# Altium schematic sheet adc.SchDoc: ADC
size A4; DrawnBy: Stefan Lippuner; Organization: TIK; DocumentNumber: 4; Revision: 1; SheetNumber: 4; SheetTotal: 8
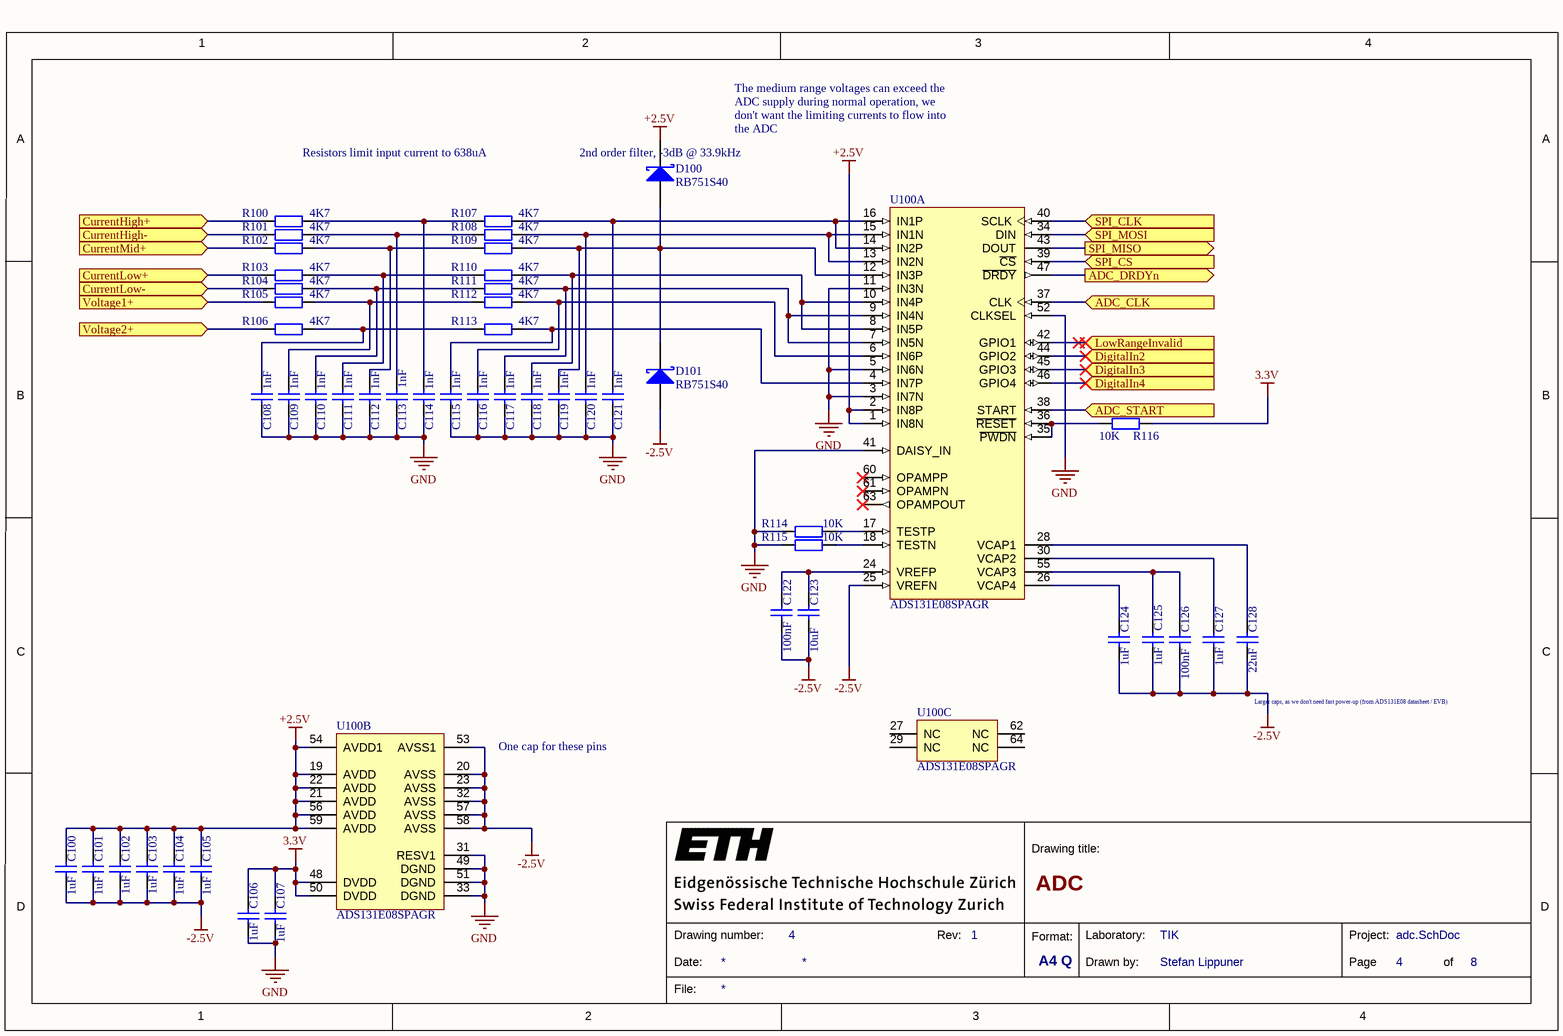
[diagram p0: adc.SchDoc]

## Parts
C100  1uF  [CAPC0402(1005)60_L]
C101  1uF  [CAPC0402(1005)60_L]
C102  1uF  [CAPC0402(1005)60_L]
C103  1uF  [CAPC0402(1005)60_L]
C104  1uF  [CAPC0402(1005)60_L]
C105  1uF  [CAPC0402(1005)60_L]
C106  1uF  [CAPC0402(1005)60_L]
C107  1uF  [CAPC0402(1005)60_L]
C108  1nF  [CAPC0402(1005)60_L]
C109  1nF  [CAPC0402(1005)60_L]
C110  1nF  [CAPC0402(1005)60_L]
C111  1nF  [CAPC0402(1005)60_L]
C112  1nF  [CAPC0402(1005)60_L]
C113  1nF  [CAPC0402(1005)60_L]
C114  1nF  [CAPC0402(1005)60_L]
C115  1nF  [CAPC0402(1005)60_L]
C116  1nF  [CAPC0402(1005)60_L]
C117  1nF  [CAPC0402(1005)60_L]
C118  1nF  [CAPC0402(1005)60_L]
C119  1nF  [CAPC0402(1005)60_L]
C120  1nF  [CAPC0402(1005)60_L]
C121  1nF  [CAPC0402(1005)60_L]
C122  100nF  [CAPC0402(1005)60_L]
C123  10uF  [CAPC0603(1608)100_L]
C124  1uF  [CAPC0402(1005)60_L]
C125  1uF  [CAPC0402(1005)60_L]
C126  100nF  [CAPC0402(1005)60_L]
C127  1uF  [CAPC0402(1005)60_L]
C128  22uF  [CAPC0805(2012)145_L]
D100  RB751S40  [ONSC-SOD-523-2-502-01_V]
D101  RB751S40  [ONSC-SOD-523-2-502-01_V]
R100  4K7  [RESC0402(1005)_L]
R101  4K7  [RESC0402(1005)_L]
R102  4K7  [RESC0402(1005)_L]
R103  4K7  [RESC0402(1005)_L]
R104  4K7  [RESC0402(1005)_L]
R105  4K7  [RESC0402(1005)_L]
R106  4K7  [RESC0402(1005)_L]
R107  4K7  [RESC0402(1005)_L]
R108  4K7  [RESC0402(1005)_L]
R109  4K7  [RESC0402(1005)_L]
R110  4K7  [RESC0402(1005)_L]
R111  4K7  [RESC0402(1005)_L]
R112  4K7  [RESC0402(1005)_L]
R113  4K7  [RESC0402(1005)_L]
R114  10K  [RESC0402(1005)_L]
R115  10K  [RESC0402(1005)_L]
R116  10K  [RESC0402(1005)_L]
U100  ADS131E08SPAGR  [QFP50P1000X1000X120_HS-64L]  (parts A,B,C of 3)

## Ports
ADC_CLK (in), ADC_DRDYn (out), ADC_START (in), CurrentHigh+ (in), CurrentHigh- (in), CurrentLow+ (in), CurrentLow- (in), CurrentMid+ (in), DigitalIn2 (in), DigitalIn3 (in), DigitalIn4 (in), LowRangeInvalid (in), SPI_CLK (in), SPI_CS (in), SPI_MISO (out), SPI_MOSI (in), Voltage1+ (in), Voltage2+ (in)

## Nets
3.3V: C106.2 C107.2 R116.1 U100.48(DVDD) U100.50(DVDD)
+2.5V: C100.2 C101.2 C102.2 C103.2 C104.2 C105.2 D100.1(K) U100.1(IN8N) U100.2(IN8P) U100.19(AVDD) U100.21(AVDD) U100.22(AVDD) U100.54(AVDD1) U100.56(AVDD) U100.59(AVDD)
-2.5V: C100.1 C101.1 C102.1 C103.1 C104.1 C105.1 C122.1 C123.1 C124.1 C125.1 C126.1 C127.1 C128.1 D101.2(A) U100.20(AVSS) U100.23(AVSS) U100.25(VREFN) U100.32(AVSS) U100.53(AVSS1) U100.57(AVSS) U100.58(AVSS)
GND: C106.1 C107.1 C108.1 C109.1 C110.1 C111.1 C112.1 C113.1 C114.1 C115.1 C116.1 C117.1 C118.1 C119.1 C120.1 C121.1 R114.1 R115.1 U100.3(IN7N) U100.5(IN6N) U100.11(IN3N) U100.31(RESV1) U100.33(DGND) U100.41(DAISY_IN) U100.49(DGND) U100.51(DGND) U100.52(CLKSEL)
ADC_CLK: U100.37(CLK) ; port ADC_CLK
ADC_DRDYn: U100.47(~{DRDY}) ; port ADC_DRDYn
ADC_START: U100.38(START) ; port ADC_START
CurrentHigh+: R100.2 ; port CurrentHigh+
CurrentHigh-: R101.2 ; port CurrentHigh-
CurrentLow+: R103.2 ; port CurrentLow+
CurrentLow-: R104.2 ; port CurrentLow-
CurrentMid+: R102.2 ; port CurrentMid+
DigitalIn2: U100.44(GPIO2) ; port DigitalIn2
DigitalIn3: U100.45(GPIO3) ; port DigitalIn3
DigitalIn4: U100.46(GPIO4) ; port DigitalIn4
LowRangeInvalid: U100.42(GPIO1) ; port LowRangeInvalid
SPI_CLK: U100.40(SCLK) ; port SPI_CLK
SPI_CS: U100.39(~{CS}) ; port SPI_CS
SPI_MISO: U100.43(DOUT) ; port SPI_MISO
SPI_MOSI: U100.34(DIN) ; port SPI_MOSI
Voltage1+: R105.2 ; port Voltage1+
Voltage2+: R106.2 ; port Voltage2+
NetC108_2: C108.2 R106.1 R113.2
NetC109_2: C109.2 R105.1 R112.2
NetC110_2: C110.2 R104.1 R111.2
NetC111_2: C111.2 R103.1 R110.2
NetC112_2: C112.2 R102.1 R109.2
NetC113_2: C113.2 R101.1 R108.2
NetC114_2: C114.2 R100.1 R107.2
NetC115_2: C115.2 R113.1 U100.4(IN7P)
NetC116_2: C116.2 R112.1 U100.6(IN6P)
NetC117_2: C117.2 R111.1 U100.7(IN5N) U100.9(IN4N)
NetC118_2: C118.2 R110.1 U100.8(IN5P) U100.10(IN4P)
NetC119_2: C119.2 D100.2(A) D101.1(K) R109.1 U100.12(IN3P)
NetC120_2: C120.2 R108.1 U100.13(IN2N) U100.15(IN1N)
NetC121_2: C121.2 R107.1 U100.14(IN2P) U100.16(IN1P)
NetC122_2: C122.2 C123.2 U100.24(VREFP)
NetC124_2: C124.2 U100.26(VCAP4)
NetC125_2: C125.2 C126.2 U100.55(VCAP3)
NetC127_2: C127.2 U100.30(VCAP2)
NetC128_2: C128.2 U100.28(VCAP1)
NetR114_2: R114.2 U100.17(TESTP)
NetR115_2: R115.2 U100.18(TESTN)
NetR116_2: R116.2 U100.35(~{PWDN}) U100.36(~{RESET})

Not connected (* = marked no-connect by the designer): U100 27(NC) 29(NC) 60(OPAMPP)* 61(OPAMPN)* 62(NC) 63(OPAMPOUT)* 64(NC)

## Notes on the sheet
- Resistors limit input current to 638uA
- 2nd order filter, -3dB @ 33.9kHz
- The medium range voltages can exceed the ADC supply during normal operation, we don't want the limiting currents to flow into the ADC
- Larger caps, as we don't need fast power-up (from ADS131E08 datasheet / EVB)
- One cap for these pins
- 1
- 2
- 3
- 4
- A
- B
- C
- Drawing title:
- D
- Date:
- Drawing number:
- Rev:
- Format:
- A4 Q
- Drawn by:
- Laboratory:
- Page
- Project:
- of
- File:

## Library data of the parts
C100-C107 C124 C125 C127 = CMP-1034-02120-1: CAP 1uF 16V ±20% 0402 (1005 Metric) Thickness 0.6mm SMD; Tolerance: Â±20%; Case-EIA: 0402; Case-Metric: 1005; Max Thickness: 0.6 mm; Rated Voltage: 16 V; Value: 1uF; Technology: SMT
C108-C121 = CMP-1034-01626-1: CAP 1nF 50V ±5% 0402 (1005 Metric) Thickness 0.6mm SMD; Case-Metric: 1005; Case-EIA: 0402; Tolerance: Â±5%; Value: 1nF; Rated Voltage: 50 V; Max Thickness: 0.6 mm; Technology: SMT
C122 C126 = CMP-1034-02071-1: CAP 100nF 16V -20% to +80% 0402 (1005 Metric) Thickness 0.6mm SMD; Case-Metric: 1005; Case-EIA: 0402; Value: 100nF; Rated Voltage: 16 V; Tolerance: -20% to +80%; Technology: SMT; Max Thickness: 0.6 mm
C123 = CMP-1035-02800-1: CAP 10uF 10V ±20% 0603 (1608 Metric) Thickness 1mm SMD; Tolerance: Â±20%; Case-EIA: 0603; Case-Metric: 1608; Max Thickness: 1 mm; Rated Voltage: 10 V; Technology: SMT; Value: 10uF
C128 = CMP-1036-04938-1: CAP 22uF 6.3V ±10% 0805 (2012 Metric) Thickness 1.45mm SMD; Tolerance: Â±10%; Case-EIA: 0805; Case-Metric: 2012; Technology: SMT; Rated Voltage: 6.3 V; Max Thickness: 1.45 mm; Value: 22uF
D100 D101 = CMP-00225-2: DIODE SCHOTTKY 40V 30MA SOD523F; Manufacturer: Fairchild Semiconductor; Voltage - Forward (Vf) (Max) @ If: 370mV @ 1mA; Speed: Small Signal =< 200mA (Io), Any Speed; Current - Reverse Leakage @ Vr: 500nA @ 10V; Packaging: Cut Tape (CT); Part Status: Active; Diode Type: Schottky; Voltage - DC Reverse (Vr) (Max): 40V; Current - Average Rectified (Io): 30mA; Reverse Recovery Time (trr): -; Capacitance @ Vr, F: -; Mounting Type: Surface Mount; Package / Case: SC-79, SOD-523F; Supplier Device Package: SOD-523F; Operating Temperature - Junction: -55°C ~ 125°C; Manufacturer Part Number: RB751S40; Supplier: Digi-Key; Supplier Part Number: RB751S40CT-ND; ComponentLink1Description: RB751S40.pdf; ComponentLink1URL: http://www.fairchildsemi.com/datasheets/RB/RB751S40.pdf
R100-R113 = CMP-1011-00586-1: 4K7 0.063W 1% 0402 (1005 Metric)  SMD; Case-Metric: 1005; Value: 4700.00 Ohm; Case-EIA: 0402; Power: 0.063 W; Technology: SMT; Tolerance: 1 %
R114-R116 = CMP-1011-00623-1: 10K 0.063W 1% 0402 (1005 Metric)  SMD; Case-Metric: 1005; Value: 10000.00 Ohm; Case-EIA: 0402; Tolerance: 1 %; Technology: SMT; Power: 0.063 W
U100 = CMP-00105-1: Analog to Digital Converters - ADC 8-Channel, 24-Bit, AFE; Brand: Texas Instruments; Product Status: New Product; Packaging: Reel; Series: ADS131E08S; Manufacturer: Texas Instruments; RoHS - Mouser: Y; Minimum Order Quantity: 1500; Reeling: True; P/N: ADS131E08SPAGR; Supplier: Mouser; Supplier Part Number: 595-ADS131E08SPAGR; ComponentLink1Description: ads131e08s-844698.pdf; ComponentLink1URL: http://www.mouser.com/ds/2/405/ads131e08s-844698.pdf